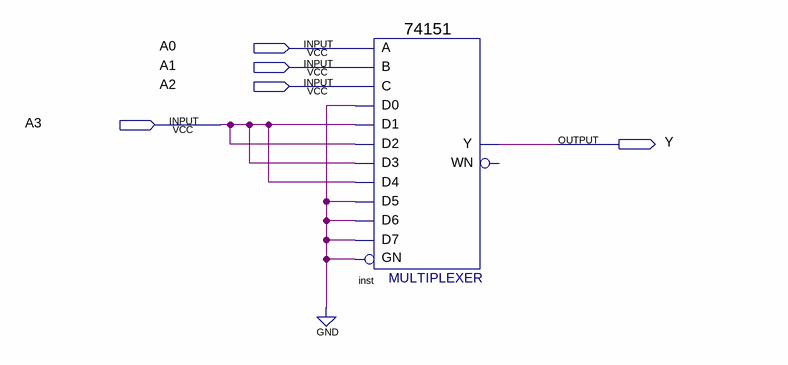
[diagram p0: schematic sheet]
// Quartus schematic Block2.bdf as structural Verilog: 1 symbols, 5 pins
module Block2 (
  input  A0,
  input  A1,
  input  A2,
  input  A3,
  output Y
);

  \74151  inst (
    .GN(1'b0), .C(A2), .B(A1), .A(A0), .D5(1'b0), .D0(1'b0), .D1(A3), .D4(A3), .D3(A3), .D2(A3), .D6(1'b0),
    .D7(1'b0), .Y(Y));  // open: WN
endmodule
